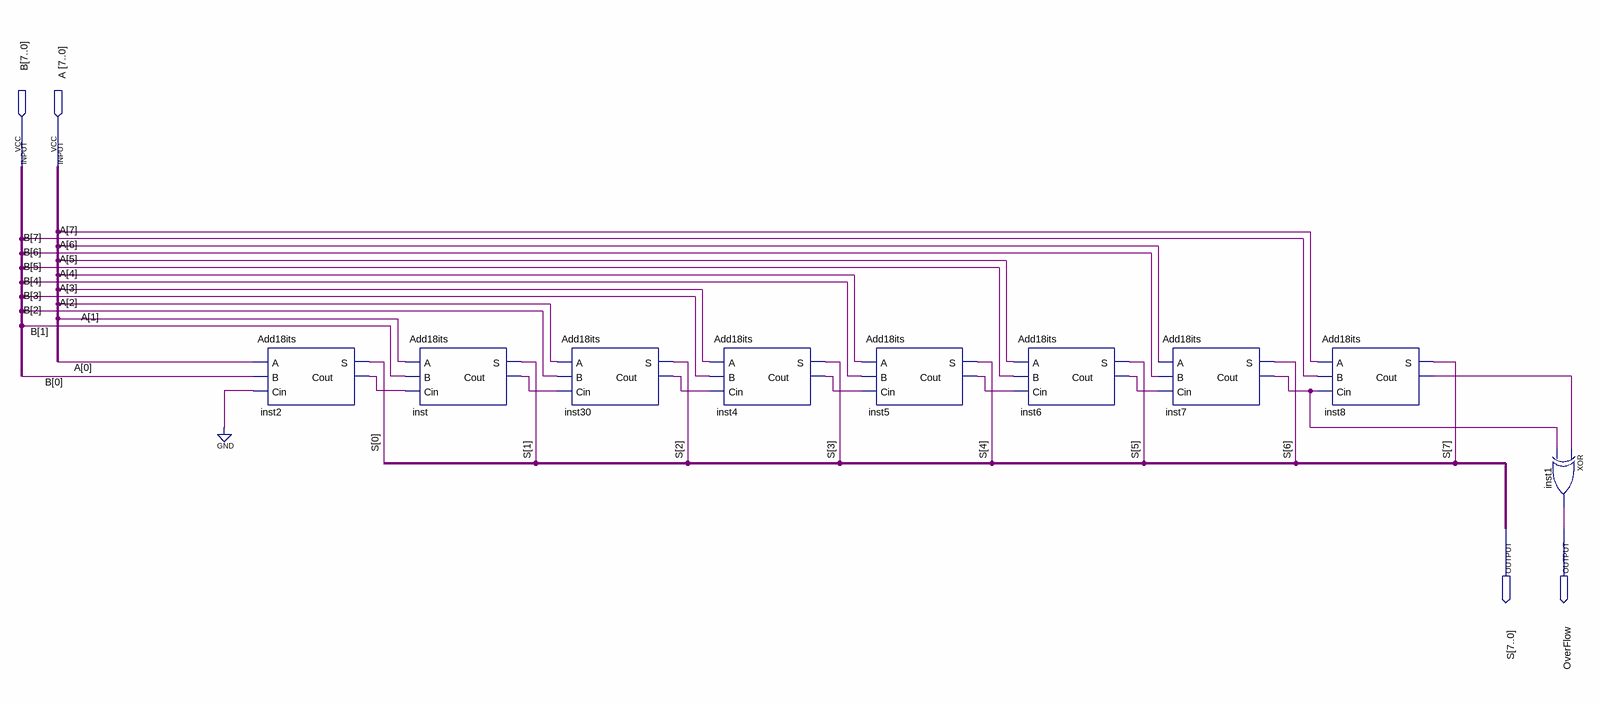
[diagram p0: schematic sheet]
// Quartus schematic Add8bits.bdf as structural Verilog: 9 symbols, 4 pins
module Add8bits (
  input  [7:0] B,
  input  [7:0] A,
  output [7:0] S,
  output OverFlow
);

  wire inst2_cout, inst4_cout, inst5_cout, inst6_cout, inst7_cout, inst8_cout, inst30_cout, inst_cout;

  Add18its inst2 (.A(A[0]), .B(B[0]), .Cin(1'b0), .S(S[0]), .Cout(inst2_cout));
  Add18its inst (.A(A[1]), .B(B[1]), .Cin(inst2_cout), .S(S[1]), .Cout(inst_cout));
  Add18its inst30 (.A(A[2]), .B(B[2]), .Cin(inst_cout), .S(S[2]), .Cout(inst30_cout));
  Add18its inst4 (.A(A[3]), .B(B[3]), .Cin(inst30_cout), .S(S[3]), .Cout(inst4_cout));
  Add18its inst5 (.A(A[4]), .B(B[4]), .Cin(inst4_cout), .S(S[4]), .Cout(inst5_cout));
  Add18its inst6 (.A(A[5]), .B(B[5]), .Cin(inst5_cout), .S(S[5]), .Cout(inst6_cout));
  Add18its inst7 (.A(A[6]), .B(B[6]), .Cin(inst6_cout), .S(S[6]), .Cout(inst7_cout));
  Add18its inst8 (.A(A[7]), .B(B[7]), .Cin(inst7_cout), .S(S[7]), .Cout(inst8_cout));
  xor inst1 (OverFlow, inst8_cout, inst7_cout);
endmodule
